# Altium schematic sheet Motion Sensor Schematic.SchDoc: Motion Sensor Schematic
size A4; Organization: Altium Limited; Address1: L3, 12a Rodborough Rd; Address2: Frenchs Forest; Address3: NSW; Address4: Australia 2086; DocumentNumber: 1; Revision: V1.0; SheetNumber: 1; SheetTotal: 1
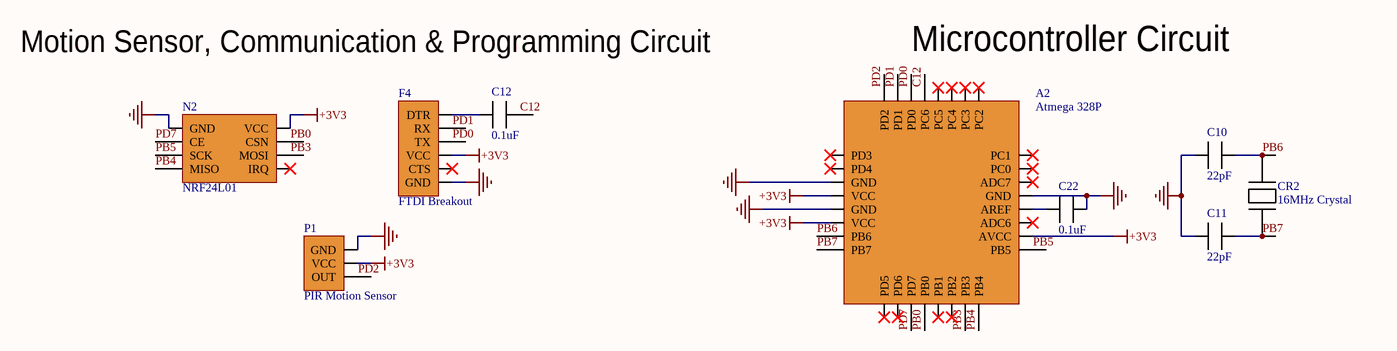
[diagram p0: Motion Sensor Schematic.SchDoc]

## Parts
A2  Atmega 328P  [ATMega328P]
C10  22pF  [22pF Capacitor]
C11  22pF  [22pF Capacitor]
C12  0.1uF  [0.1uF Capacitor]
C22  0.1uF  [0.1uF Capacitor]
CR2  16MHz Crystal  [16MHz Crystal]
F4  FTDI Breakout  [FTDI]
N2  NRF24L01  [NRF24L01]
P1  PIR Motion Sensor  [PIR Motion Sensor]

## Nets
+3V3: A2.4(VCC) A2.6(VCC) A2.18(AVCC) F4.4(VCC) N2.5(VCC) P1.2(VCC)
GND: A2.3(GND) A2.5(GND) A2.21(GND) C10.1 C11.1 C22.2 F4.6(GND) N2.1(GND) P1.1(GND)
C12: A2.29(PC6) C12.2
PB0: A2.12(PB0) N2.6(CSN)
PB3: A2.15(PB3) N2.7(MOSI)
PB4: A2.16(PB4) N2.4(MISO)
PB5: A2.17(PB5) N2.3(SCK)
PB6: A2.7(PB6) C10.2 CR2.2
PB7: A2.8(PB7) C11.2 CR2.1
PD0: A2.30(PD0) F4.3(TX)
PD1: A2.31(PD1) F4.2(RX)
PD2: A2.32(PD2) P1.3(OUT)
PD7: A2.11(PD7) N2.2(CE)
NetA2_20: A2.20(AREF) C22.1
NetC12_1: C12.1 F4.1(DTR)

Not connected (* = marked no-connect by the designer): A2 1(PD3)* 2(PD4)* 9(PD5)* 10(PD6)* 13(PB1)* 14(PB2)* 19(ADC6)* 22(ADC7)* 23(PC0)* 24(PC1)* 25(PC2)* 26(PC3)* 27(PC4)* 28(PC5)*; F4 5(CTS)*; N2 8(IRQ)*

## Notes on the sheet
- Motion Sensor, Communication & Programming Circuit
- (near A2) Microcontroller Circuit
- Title
- Size:
- Date:
- A4
- Number:
- Time:
- Revision:
- Sheet
- of
- File:

## Library data of the parts
A2 = ATMEGA328PB-AUR: IC MCU 8BIT 32KB FLASH 32TQFP; Manufacturer: Microchip; Interface: I2C,SPI,UART,USART; Peripherals: Brown-out Detect/Reset,POR,PWM,WDT; Core Architecture: AVR; Frequency: 20MHz; Number of I/Os: 27; Oscillator Type: Internal; Supplier 1: Digi-Key; Manufacturer Part Number: ATMEGA328PB-AUR; RoHS: No; Category: Microcontrollers; Stock 1: 9971; Pricing 1: 1=1.42000, 25=1.30000, 100=1.18000 (USD); Case/Package: TQFP; Number of Pins: 32; Min Operating Temperature: -40°C; Max Operating Temperature: 85°C; Memory Type: FLASH; Packaging: Tape and Reel; Memory Size: 32KB; ComponentLink1URL: http://www.microchip.com/mymicrochip/filehandler.aspx?ddocname=en589666&src-supplier=Digi-Key; ComponentLink1Description: http://www.microchip.com/mymicrochip/filehandler.aspx?ddocname=en589666&src-supplier=Digi-Key; Supplier Part Number 1: ATMEGA328PB-AURCT-ND
C10 C11 = 06035A220JAT2A: Cap Ceramic 22pF 50V C0G 5% SMD 0603 125C Paper T/R; Manufacturer: Kyocera AVX; Insulation Resistance: 100GR; Temperature Coefficient: 30ppm/°C; Supplier 1: Digi-Key; Manufacturer Part Number: 06035A220JAT2A; RoHS: Yes; Category: Ceramic Capacitors; Stock 1: 678111; Pricing 1: 1=0.10000, 10=0.05600, 50=0.03040, 100=0.02480, 500=0.01772, 1000=0.01392 (USD); Mount: Surface Mount,PCB; Case/Package: 0603; Number of Pins: 2; Case Code (Imperial): 0603; Case Code (Metric): 1608; Contact Plating: Tin,Matte; Dielectric Material: Ceramic; Min Operating Temperature: -55°C; Max Operating Temperature: 125°C; Tolerance: 5%; Capacitance: 22pF; Voltage Rating (DC): 50V; Packaging: Tape and Reel; Dielectric: C0G; Voltage: 50V; Voltage Rating: 50V; Package Quantity: 1; Termination: SMD/SMT; Length: 1.6mm; Width: 0.81mm; Height: 0.63mm; Thickness: 0.035inch; Depth: 0.81mm; Radiation Hardening: No; REACH SVHC: No SVHC; Lead Free: Lead Free; ComponentLink1URL: https://datasheet.ciiva.com/11788/0900766b802d4697-11788031.pdf?src-supplier=RSComponents; ComponentLink1Description: https://datasheet.ciiva.com/11788/0900766b802d4697-11788031.pdf?src-supplier=RSComponents; ComponentLink2URL: https://datasheet.ciiva.com/16351/ccog-16351125.pdf?src-supplier=Future+Electronics; ComponentLink2Description: https://datasheet.ciiva.com/16351/ccog-16351125.pdf?src-supplier=Future+Electronics; ComponentLink3URL: https://datasheet.ciiva.com/1124/759117-1124728.pdf?src-supplier=Element14; ComponentLink3Description: https://datasheet.ciiva.com/1124/759117-1124728.pdf?src-supplier=Element14; ComponentLink4URL: https://datasheet.ciiva.com/7855/759117-7855064.pdf?src-supplier=Element14; ComponentLink4Description: https://datasheet.ciiva.com/7855/759117-7855064.pdf?src-supplier=Element14; ComponentLink5URL: https://datasheet.ciiva.com/150/ccog-150366.pdf?src-supplier=Digi-Key; ComponentLink5Description: https://datasheet.ciiva.com/150/ccog-150366.pdf?src-supplier=Digi-Key; ComponentLink6URL: https://datasheet.ciiva.com/150/ccog-150367.pdf?src-supplier=Digi-Key; ComponentLink6Description: https://datasheet.ciiva.com/150/ccog-150367.pdf?src-supplier=Digi-Key; Supplier Part Number 1: 478-1167-1-ND
C12 C22 = 06033C104KAT4A: CAP CER 0.1UF 25V X7R 0603; Manufacturer: Kyocera AVX; Capacitance: 100nF; Tolerance: 10%; Supplier 1: Digi-Key; Manufacturer Part Number: 06033C104KAT4A; RoHS: Yes; Category: Ceramic Capacitors; Stock 1: 6112957; Pricing 1: 1=0.10000, 10=0.04200, 50=0.02320, 100=0.01890, 500=0.01348, 1000=0.01059, 2500=0.00962, 5000=0.00886 (USD); Mount: Surface Mount; Case/Package: 0603; Number of Pins: 2; Case Code (Metric): 1608; Case Code (Imperial): 0603; Min Operating Temperature: -55°C; Max Operating Temperature: 125°C; Packaging: Tape and Reel; Voltage Rating (DC): 25V; Dielectric: X7R; Package Quantity: 1; Voltage Rating: 25V; Termination: SMD/SMT; Length: 1.6mm; Width: 0.032inch; Height: 0.9mm; Thickness: 0.035inch; Depth: 0.81mm; REACH SVHC: No SVHC; Lead Free: Lead Free; ComponentLink1URL: https://datasheet.ciiva.com/22619/1679506-22619862.pdf?src-supplier=Element14; ComponentLink1Description: https://datasheet.ciiva.com/22619/1679506-22619862.pdf?src-supplier=Element14; ComponentLink2URL: https://datasheet.ciiva.com/28613/1679506-28613035.pdf?src-supplier=Element14; ComponentLink2Description: https://datasheet.ciiva.com/28613/1679506-28613035.pdf?src-supplier=Element14; ComponentLink3URL: https://datasheet.ciiva.com/6277/cx7r-6277758.pdf?src-supplier=Digi-Key; ComponentLink3Description: https://datasheet.ciiva.com/6277/cx7r-6277758.pdf?src-supplier=Digi-Key; ComponentLink4URL: https://datasheet.ciiva.com/6277/cx7r-6277759.pdf?src-supplier=Digi-Key; ComponentLink4Description: https://datasheet.ciiva.com/6277/cx7r-6277759.pdf?src-supplier=Digi-Key; Supplier Part Number 1: 478-7018-1-ND
CR2 = ECS-160-20-3X-TR: CRYSTAL 16.0000MHZ 20PF SMD; Manufacturer: ECS International; Frequency Tolerance: 30ppm; ESR (Equivalent Series Resistance): 50R; Frequency Stability: 50ppm; Supplier 1: Digi-Key; Manufacturer Part Number: ECS-160-20-3X-TR; RoHS: Yes; Category: Crystals; Stock 1: 6685; Pricing 1: 1=0.35000, 10=0.28800, 50=0.25880, 100=0.23000, 500=0.21850, 1000=0.18400 (USD); Mount: Surface Mount; Min Operating Temperature: -10°C; Max Operating Temperature: 70°C; Package Quantity: 1; Frequency: 16MHz; Load Capacitance: 20pF; Packaging: Tape and Reel; Tolerance: 30ppm; Termination: SMD/SMT; Length: 0.276inch; Width: 0.161inch; Height: 0.091inch; Lead Free: Lead Free; ComponentLink1URL: https://datasheet.ciiva.com/852/csm-3x-852328.pdf?src-supplier=Digi-Key; ComponentLink1Description: https://datasheet.ciiva.com/852/csm-3x-852328.pdf?src-supplier=Digi-Key; ComponentLink2URL: https://datasheet.ciiva.com/852/csm-3x-852329.pdf?src-supplier=Digi-Key; ComponentLink2Description: https://datasheet.ciiva.com/852/csm-3x-852329.pdf?src-supplier=Digi-Key; ComponentLink3URL: https://datasheet.ciiva.com/852/csm-3x-852330.pdf?src-supplier=Digi-Key; ComponentLink3Description: https://datasheet.ciiva.com/852/csm-3x-852330.pdf?src-supplier=Digi-Key; Supplier Part Number 1: XC1776CT-ND
F4 = FTDI: FTDI USB to TTL serial converter module
N2 = NRF24L01: 3.3V NRF24L01 WIRELESS RF MODULE
P1 = 555-28027: Pyroelectric IR sensor, 555-28027, Parallax; Sensing Method: Infrared (IR); Max Supply Voltage (DC): 6V; Min Supply Voltage (DC): 3V; Sensing Distance: 240inch; Operating Supply Current: 23mA; Supplier 1: Digi-Key; Manufacturer: Parallax; Manufacturer Part Number: 555-28027; RoHS: Yes; Category: Embedded Processors and Controllers; Stock 1: 2330; Pricing 1: 1=14.99000, 5=14.40000 (USD); Case/Package: Module; Weight: 0.3264oz; Min Operating Temperature: 0°C; Max Operating Temperature: 50°C; Packaging: Bulk; Package Quantity: 1; Length: 32.2mm; Width: 24.3mm; Height: 25.4mm; ComponentLink1URL: https://datasheet.ciiva.com/14091/555-28027-eng-tds-14091219.pdf?src-supplier=Distrelec; ComponentLink1Description: https://datasheet.ciiva.com/14091/555-28027-eng-tds-14091219.pdf?src-supplier=Distrelec; ComponentLink2URL: https://datasheet.ciiva.com/5297/pirsensor-v1-2-27724-5297156.pdf?src-supplier=Mouser; ComponentLink2Description: https://datasheet.ciiva.com/5297/pirsensor-v1-2-27724-5297156.pdf?src-supplier=Mouser; ComponentLink3URL: https://datasheet.ciiva.com/19458/2082927-19458486.pdf?src-supplier=Jameco; ComponentLink3Description: https://datasheet.ciiva.com/19458/2082927-19458486.pdf?src-supplier=Jameco; ComponentLink4URL: https://datasheet.ciiva.com/30475/0900766b8125a3ed-30475657.pdf?src-supplier=RSComponents; ComponentLink4Description: https://datasheet.ciiva.com/30475/0900766b8125a3ed-30475657.pdf?src-supplier=RSComponents; ComponentLink5URL: https://datasheet.ciiva.com/2818/555-28027-pir-sensor-prodcut-doc-v2-2-2818610.pdf?src-supplier=Digi-Key; ComponentLink5Description: https://datasheet.ciiva.com/2818/555-28027-pir-sensor-prodcut-doc-v2-2-2818610.pdf?src-supplier=Digi-Key; Supplier Part Number 1: 555-28027-ND